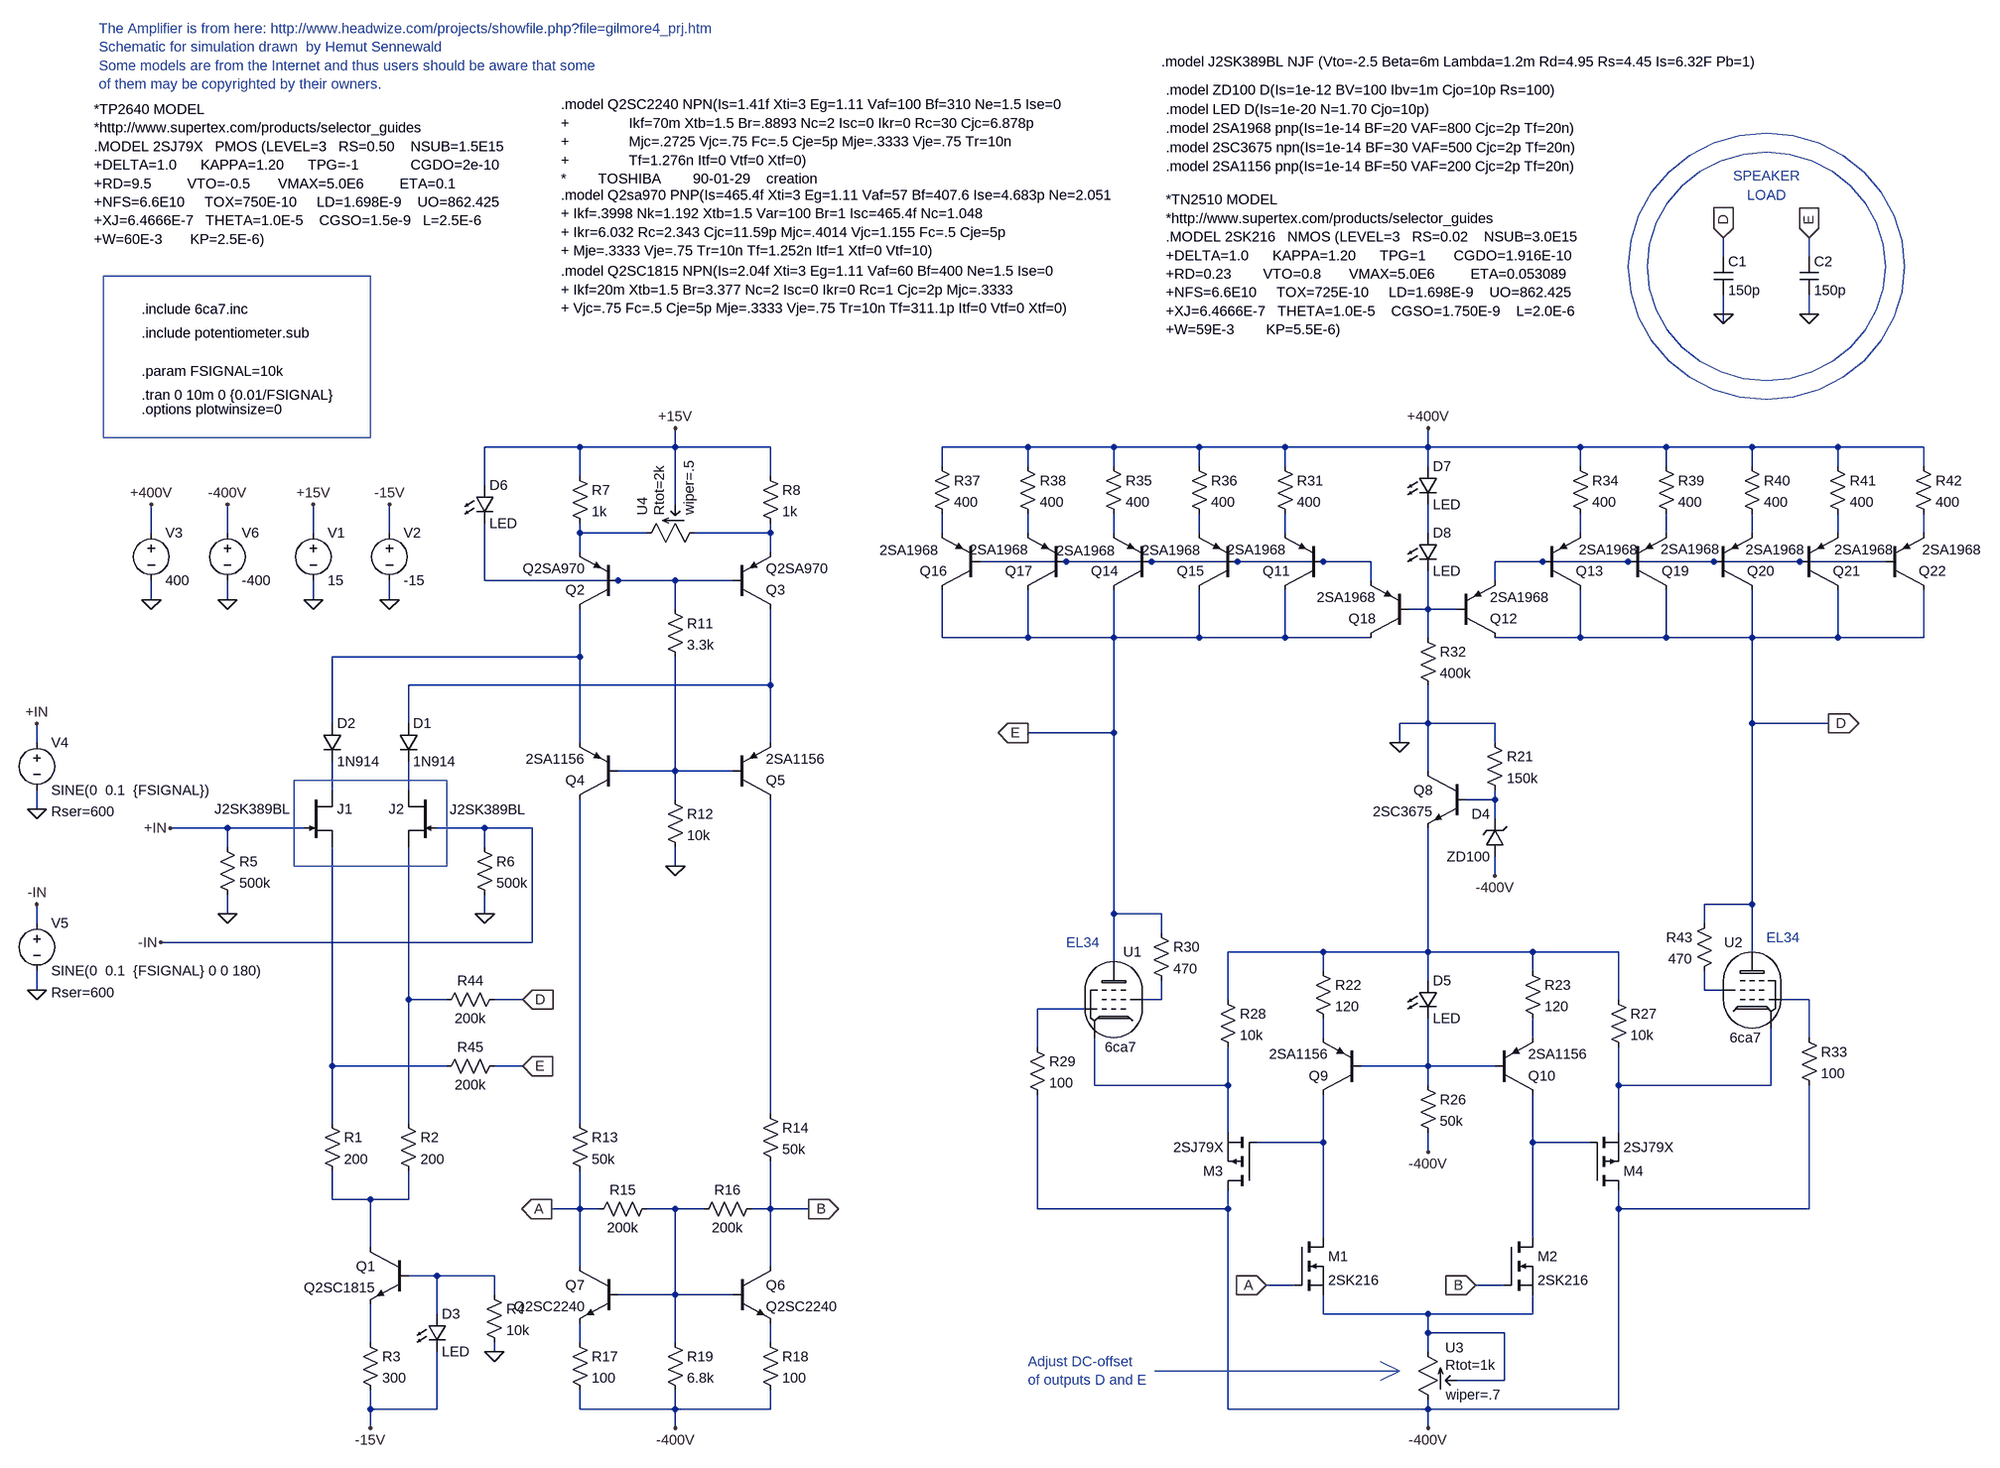
[diagram p0: schematic headwize4.asc]
headwize4.asc, the LTspice schematic file:
Version 4
SHEET 1 4132 1764
WIRE -448 -144 -448 -176
WIRE -448 -32 -448 -64
WIRE -448 160 -448 128
WIRE -448 272 -448 240
WIRE -256 -496 -256 -544
WIRE -256 -384 -256 -416
WIRE -128 -496 -128 -544
WIRE -128 -384 -128 -416
WIRE -128 0 -224 0
WIRE -128 32 -128 0
WIRE -128 144 -128 112
WIRE 0 0 -128 0
WIRE 16 -496 16 -544
WIRE 16 -384 16 -416
WIRE 48 -176 48 -288
WIRE 48 -64 48 -112
WIRE 48 400 48 32
WIRE 48 496 48 400
WIRE 48 624 48 576
WIRE 112 624 48 624
WIRE 112 704 112 624
WIRE 112 864 112 800
WIRE 112 976 112 944
WIRE 112 1008 112 976
WIRE 144 -496 144 -544
WIRE 144 -384 144 -416
WIRE 176 -176 176 -240
WIRE 176 -64 176 -112
WIRE 176 288 176 32
WIRE 176 496 176 288
WIRE 176 624 112 624
WIRE 176 624 176 576
WIRE 224 752 176 752
WIRE 224 816 224 752
WIRE 224 976 112 976
WIRE 224 976 224 880
WIRE 240 288 176 288
WIRE 240 400 48 400
WIRE 304 -576 304 -640
WIRE 304 -416 304 -512
WIRE 304 0 224 0
WIRE 304 32 304 0
WIRE 304 144 304 112
WIRE 320 752 224 752
WIRE 320 784 320 752
WIRE 320 880 320 864
WIRE 368 288 320 288
WIRE 368 400 320 400
WIRE 384 0 304 0
WIRE 384 192 -240 192
WIRE 384 192 384 0
WIRE 464 -640 304 -640
WIRE 464 -592 464 -640
WIRE 464 -496 464 -512
WIRE 464 -464 464 -496
WIRE 464 -288 48 -288
WIRE 464 -288 464 -368
WIRE 464 -144 464 -288
WIRE 464 496 464 -48
WIRE 464 640 416 640
WIRE 464 640 464 576
WIRE 464 736 464 640
WIRE 464 864 464 832
WIRE 464 976 464 944
WIRE 496 640 464 640
WIRE 528 -416 304 -416
WIRE 576 -496 464 -496
WIRE 624 -640 464 -640
WIRE 624 -640 624 -672
WIRE 624 -544 624 -640
WIRE 624 -416 528 -416
WIRE 624 -368 624 -416
WIRE 624 -96 528 -96
WIRE 624 -96 624 -288
WIRE 624 -48 624 -96
WIRE 624 64 624 32
WIRE 624 640 576 640
WIRE 624 784 528 784
WIRE 624 784 624 640
WIRE 624 864 624 784
WIRE 624 976 464 976
WIRE 624 976 624 944
WIRE 624 1008 624 976
WIRE 672 640 624 640
WIRE 720 -416 624 -416
WIRE 720 -96 624 -96
WIRE 720 784 624 784
WIRE 784 -640 624 -640
WIRE 784 -592 784 -640
WIRE 784 -496 656 -496
WIRE 784 -496 784 -512
WIRE 784 -464 784 -496
WIRE 784 -240 176 -240
WIRE 784 -240 784 -368
WIRE 784 -144 784 -240
WIRE 784 480 784 -48
WIRE 784 640 752 640
WIRE 784 640 784 560
WIRE 784 736 784 640
WIRE 784 864 784 832
WIRE 784 976 624 976
WIRE 784 976 784 944
WIRE 848 640 784 640
WIRE 1072 -608 1072 -640
WIRE 1072 -496 1072 -528
WIRE 1072 -320 1072 -400
WIRE 1216 -640 1072 -640
WIRE 1216 -608 1216 -640
WIRE 1216 -496 1216 -528
WIRE 1216 -320 1072 -320
WIRE 1216 -320 1216 -400
WIRE 1232 368 1232 304
WIRE 1232 640 1232 448
WIRE 1280 -448 1136 -448
WIRE 1312 304 1232 304
WIRE 1328 432 1328 352
WIRE 1360 -640 1216 -640
WIRE 1360 -608 1360 -640
WIRE 1360 -496 1360 -528
WIRE 1360 -320 1216 -320
WIRE 1360 -320 1360 -400
WIRE 1360 -160 1216 -160
WIRE 1360 -160 1360 -320
WIRE 1360 144 1360 -160
WIRE 1360 224 1360 144
WIRE 1424 -448 1280 -448
WIRE 1440 144 1360 144
WIRE 1440 176 1440 144
WIRE 1440 288 1408 288
WIRE 1440 288 1440 256
WIRE 1504 -640 1360 -640
WIRE 1504 -608 1504 -640
WIRE 1504 -496 1504 -528
WIRE 1504 -320 1360 -320
WIRE 1504 -320 1504 -400
WIRE 1552 288 1552 208
WIRE 1552 432 1328 432
WIRE 1552 432 1552 368
WIRE 1552 512 1552 432
WIRE 1552 640 1232 640
WIRE 1552 640 1552 608
WIRE 1552 976 1552 640
WIRE 1568 -448 1424 -448
WIRE 1648 -640 1504 -640
WIRE 1648 -608 1648 -640
WIRE 1648 -496 1648 -528
WIRE 1648 -320 1504 -320
WIRE 1648 -320 1648 -400
WIRE 1664 768 1616 768
WIRE 1712 -448 1568 -448
WIRE 1712 208 1552 208
WIRE 1712 240 1712 208
WIRE 1712 352 1712 320
WIRE 1712 528 1600 528
WIRE 1712 528 1712 448
WIRE 1712 688 1712 528
WIRE 1712 816 1712 784
WIRE 1792 -448 1712 -448
WIRE 1792 -416 1792 -448
WIRE 1792 -320 1648 -320
WIRE 1840 -144 1840 -176
WIRE 1888 -640 1648 -640
WIRE 1888 -640 1888 -672
WIRE 1888 -608 1888 -640
WIRE 1888 -496 1888 -544
WIRE 1888 -368 1856 -368
WIRE 1888 -368 1888 -432
WIRE 1888 -320 1888 -368
WIRE 1888 -176 1840 -176
WIRE 1888 -176 1888 -240
WIRE 1888 -96 1888 -176
WIRE 1888 208 1712 208
WIRE 1888 208 1888 0
WIRE 1888 256 1888 208
WIRE 1888 400 1776 400
WIRE 1888 400 1888 320
WIRE 1888 432 1888 400
WIRE 1888 544 1888 512
WIRE 1888 816 1712 816
WIRE 1888 848 1888 816
WIRE 1888 880 1888 848
WIRE 1888 976 1552 976
WIRE 1888 976 1888 960
WIRE 1888 1008 1888 976
WIRE 1936 -368 1888 -368
WIRE 2000 -416 2000 -448
WIRE 2000 -176 1888 -176
WIRE 2000 -144 2000 -176
WIRE 2000 -48 1952 -48
WIRE 2000 -48 2000 -64
WIRE 2000 -16 2000 -48
WIRE 2000 80 2000 48
WIRE 2000 400 1888 400
WIRE 2016 768 1968 768
WIRE 2016 848 1888 848
WIRE 2016 928 1936 928
WIRE 2016 928 2016 848
WIRE 2064 208 1888 208
WIRE 2064 240 2064 208
WIRE 2064 352 2064 320
WIRE 2064 528 2064 448
WIRE 2064 688 2064 528
WIRE 2064 816 1888 816
WIRE 2064 816 2064 784
WIRE 2080 -448 2000 -448
WIRE 2144 -640 1888 -640
WIRE 2144 -608 2144 -640
WIRE 2144 -496 2144 -528
WIRE 2144 -320 2000 -320
WIRE 2144 -320 2144 -400
WIRE 2160 528 2064 528
WIRE 2208 208 2064 208
WIRE 2208 288 2208 208
WIRE 2208 432 2208 368
WIRE 2208 512 2208 432
WIRE 2208 640 2208 608
WIRE 2208 976 1888 976
WIRE 2208 976 2208 640
WIRE 2224 -448 2080 -448
WIRE 2288 -640 2144 -640
WIRE 2288 -608 2288 -640
WIRE 2288 -496 2288 -528
WIRE 2288 -320 2144 -320
WIRE 2288 -320 2288 -400
WIRE 2352 160 2352 128
WIRE 2352 272 2352 240
WIRE 2368 -448 2224 -448
WIRE 2384 -960 2384 -992
WIRE 2384 -864 2384 -896
WIRE 2384 -848 2384 -864
WIRE 2384 272 2352 272
WIRE 2432 -640 2288 -640
WIRE 2432 -608 2432 -640
WIRE 2432 -496 2432 -528
WIRE 2432 -320 2288 -320
WIRE 2432 -320 2432 -400
WIRE 2432 -176 2432 -320
WIRE 2432 128 2352 128
WIRE 2432 128 2432 -176
WIRE 2432 208 2432 128
WIRE 2464 432 2208 432
WIRE 2464 432 2464 336
WIRE 2512 -448 2368 -448
WIRE 2528 -960 2528 -992
WIRE 2528 -864 2528 -896
WIRE 2528 288 2480 288
WIRE 2528 352 2528 288
WIRE 2528 640 2208 640
WIRE 2528 640 2528 432
WIRE 2560 -176 2432 -176
WIRE 2576 -640 2432 -640
WIRE 2576 -608 2576 -640
WIRE 2576 -496 2576 -528
WIRE 2576 -320 2432 -320
WIRE 2576 -320 2576 -400
WIRE 2656 -448 2512 -448
WIRE 2720 -640 2576 -640
WIRE 2720 -608 2720 -640
WIRE 2720 -496 2720 -528
WIRE 2720 -320 2576 -320
WIRE 2720 -320 2720 -400
FLAG 320 880 0
FLAG 112 1008 -15V
FLAG 304 144 0
FLAG -128 144 0
FLAG 624 64 0
FLAG 624 -672 +15V
FLAG 624 1008 -400V
FLAG -224 0 +IN
FLAG -240 192 -IN
FLAG 144 -384 0
FLAG 16 -384 0
FLAG 144 -544 -15V
FLAG 16 -544 +15V
FLAG -448 -32 0
FLAG -448 272 0
FLAG -448 -176 +IN
FLAG -448 128 -IN
FLAG -256 -384 0
FLAG -256 -544 +400V
FLAG -128 -384 0
FLAG -128 -544 -400V
FLAG 1968 768 B
IOPIN 1968 768 In
FLAG 848 640 B
IOPIN 848 640 Out
FLAG 416 640 A
IOPIN 416 640 Out
FLAG 1616 768 A
IOPIN 1616 768 In
FLAG 1888 1008 -400V
FLAG 1840 -144 0
FLAG 2000 80 -400V
FLAG 1888 544 -400V
FLAG 1888 -672 +400V
FLAG 368 288 D
IOPIN 368 288 In
FLAG 368 400 E
IOPIN 368 400 In
FLAG 2560 -176 D
IOPIN 2560 -176 Out
FLAG 1216 -160 E
IOPIN 1216 -160 Out
FLAG 2384 -864 0
FLAG 2528 -864 0
FLAG 2384 -992 D
IOPIN 2384 -992 In
FLAG 2528 -992 E
IOPIN 2528 -992 In
SYMBOL njf 0 -64 R0
WINDOW 3 -150 32 Left 0
SYMATTR Value J2SK389BL
SYMATTR InstName J1
SYMBOL njf 224 -64 M0
WINDOW 3 -148 33 Left 0
SYMATTR Value J2SK389BL
SYMATTR InstName J2
SYMBOL diode 160 -176 R0
SYMATTR InstName D1
SYMATTR Value 1N914
SYMBOL diode 32 -176 R0
SYMATTR InstName D2
SYMATTR Value 1N914
SYMBOL res 32 480 R0
SYMATTR InstName R1
SYMATTR Value 200
SYMBOL res 160 480 R0
SYMATTR InstName R2
SYMATTR Value 200
SYMBOL npn 176 704 M0
SYMATTR InstName Q1
SYMATTR Value Q2SC1815
SYMBOL res 96 848 R0
SYMATTR InstName R3
SYMATTR Value 300
SYMBOL res 304 768 R0
SYMATTR InstName R4
SYMATTR Value 10k
SYMBOL res -144 16 R0
SYMATTR InstName R5
SYMATTR Value 500k
SYMBOL res 288 16 R0
SYMATTR InstName R6
SYMATTR Value 500k
SYMBOL pnp 528 -368 R180
SYMATTR InstName Q2
SYMATTR Value Q2SA970
SYMBOL pnp 720 -368 M180
SYMATTR InstName Q3
SYMATTR Value Q2SA970
SYMBOL res 448 -608 R0
SYMATTR InstName R7
SYMATTR Value 1k
SYMBOL res 768 -608 R0
SYMATTR InstName R8
SYMATTR Value 1k
SYMBOL pnp 528 -48 R180
SYMATTR InstName Q4
SYMATTR Value 2SA1156
SYMBOL pnp 720 -48 M180
SYMATTR InstName Q5
SYMATTR Value 2SA1156
SYMBOL res 608 -384 R0
SYMATTR InstName R11
SYMATTR Value 3.3k
SYMBOL res 608 -64 R0
SYMATTR InstName R12
SYMATTR Value 10k
SYMBOL res 448 480 R0
SYMATTR InstName R13
SYMATTR Value 50k
SYMBOL res 768 464 R0
SYMATTR InstName R14
SYMATTR Value 50k
SYMBOL npn 720 736 R0
SYMATTR InstName Q6
SYMATTR Value Q2SC2240
SYMBOL npn 528 736 M0
SYMATTR InstName Q7
SYMATTR Value Q2SC2240
SYMBOL res 480 656 R270
WINDOW 0 32 56 VTop 0
WINDOW 3 0 56 VBottom 0
SYMATTR InstName R15
SYMATTR Value 200k
SYMBOL res 656 656 R270
WINDOW 0 32 56 VTop 0
WINDOW 3 0 56 VBottom 0
SYMATTR InstName R16
SYMATTR Value 200k
SYMBOL res 448 848 R0
SYMATTR InstName R17
SYMATTR Value 100
SYMBOL res 768 848 R0
SYMATTR InstName R18
SYMATTR Value 100
SYMBOL res 608 848 R0
SYMATTR InstName R19
SYMATTR Value 6.8k
SYMBOL voltage 16 -512 R0
SYMATTR InstName V1
SYMATTR Value 15
SYMBOL voltage 144 -512 R0
SYMATTR InstName V2
SYMATTR Value -15
SYMBOL voltage -448 -160 R0
WINDOW 123 0 0 Left 0
WINDOW 39 24 132 Left 0
SYMATTR SpiceLine Rser=600
SYMATTR InstName V4
SYMATTR Value SINE(0  0.1  {FSIGNAL})
SYMBOL voltage -448 144 R0
WINDOW 123 0 0 Left 0
WINDOW 39 24 132 Left 0
SYMATTR SpiceLine Rser=600
SYMATTR InstName V5
SYMATTR Value SINE(0  0.1  {FSIGNAL} 0 0 180)
SYMBOL LED 288 -576 R0
SYMATTR InstName D6
SYMATTR Value LED
SYMBOL LED 208 816 R0
SYMATTR InstName D3
SYMATTR Value LED
SYMBOL voltage -256 -512 R0
SYMATTR InstName V3
SYMATTR Value 400
SYMBOL voltage -128 -512 R0
SYMATTR InstName V6
SYMATTR Value -400
SYMBOL nmos 1664 688 R0
SYMATTR InstName M1
SYMATTR Value 2SK216
SYMBOL nmos 2016 688 R0
SYMATTR InstName M2
SYMATTR Value 2SK216
SYMBOL npn 1952 -96 M0
SYMATTR InstName Q8
SYMATTR Value 2SC3675
SYMBOL res 1984 -160 R0
SYMATTR InstName R21
SYMATTR Value 150k
SYMBOL zener 2016 48 R180
WINDOW 0 24 72 Left 0
WINDOW 3 24 0 Left 0
SYMATTR InstName D4
SYMATTR Value ZD100
SYMBOL pnp 1776 448 R180
SYMATTR InstName Q9
SYMATTR Value 2SA1156
SYMBOL pnp 2000 448 M180
SYMATTR InstName Q10
SYMATTR Value 2SA1156
SYMBOL res 1696 224 R0
SYMATTR InstName R22
SYMATTR Value 120
SYMBOL res 2048 224 R0
SYMATTR InstName R23
SYMATTR Value 120
SYMBOL res 1872 416 R0
SYMATTR InstName R26
SYMATTR Value 50k
SYMBOL LED 1872 256 R0
SYMATTR InstName D5
SYMATTR Value LED
SYMBOL pmos 1600 608 R180
SYMATTR InstName M3
SYMATTR Value 2SJ79X
SYMBOL pmos 2160 608 M180
SYMATTR InstName M4
SYMATTR Value 2SJ79X
SYMBOL res 2192 272 R0
SYMATTR InstName R27
SYMATTR Value 10k
SYMBOL res 1536 272 R0
SYMATTR InstName R28
SYMATTR Value 10k
SYMBOL xpentode4 1360 288 R0
SYMATTR InstName U1
SYMATTR Value 6ca7
SYMBOL res 1424 160 R0
SYMATTR InstName R30
SYMATTR Value 470
SYMBOL pnp 1712 -400 R180
WINDOW 3 63 68 Left 0
SYMATTR Value 2SA1968
SYMATTR InstName Q11
SYMBOL pnp 1936 -320 M180
SYMATTR InstName Q12
SYMATTR Value 2SA1968
SYMBOL res 1632 -624 R0
SYMATTR InstName R31
SYMATTR Value 400
SYMBOL LED 1872 -608 R0
SYMATTR InstName D7
SYMATTR Value LED
SYMBOL pnp 1424 -400 R180
WINDOW 3 61 66 Left 0
SYMATTR Value 2SA1968
SYMATTR InstName Q14
SYMBOL res 1344 -624 R0
SYMATTR InstName R35
SYMATTR Value 400
SYMBOL pnp 1568 -400 R180
WINDOW 3 62 67 Left 0
SYMATTR Value 2SA1968
SYMATTR InstName Q15
SYMBOL res 1488 -624 R0
SYMATTR InstName R36
SYMATTR Value 400
SYMBOL pnp 1136 -400 R180
WINDOW 3 70 67 Left 0
SYMATTR Value 2SA1968
SYMATTR InstName Q16
SYMBOL res 1056 -624 R0
SYMATTR InstName R37
SYMATTR Value 400
SYMBOL pnp 1280 -400 R180
WINDOW 3 63 68 Left 0
SYMATTR Value 2SA1968
SYMATTR InstName Q17
SYMBOL res 1200 -624 R0
SYMATTR InstName R38
SYMATTR Value 400
SYMBOL pnp 1856 -320 R180
SYMATTR InstName Q18
SYMATTR Value 2SA1968
SYMBOL pnp 2080 -400 M180
WINDOW 3 61 68 Left 0
SYMATTR Value 2SA1968
SYMATTR InstName Q13
SYMBOL res 2128 -624 R0
SYMATTR InstName R34
SYMATTR Value 400
SYMBOL pnp 2224 -400 M180
WINDOW 3 55 69 Left 0
SYMATTR Value 2SA1968
SYMATTR InstName Q19
SYMBOL res 2272 -624 R0
SYMATTR InstName R39
SYMATTR Value 400
SYMBOL pnp 2368 -400 M180
WINDOW 3 53 68 Left 0
SYMATTR Value 2SA1968
SYMATTR InstName Q20
SYMBOL res 2416 -624 R0
SYMATTR InstName R40
SYMATTR Value 400
SYMBOL pnp 2512 -400 M180
WINDOW 3 58 68 Left 0
SYMATTR Value 2SA1968
SYMATTR InstName Q21
SYMBOL res 2560 -624 R0
SYMATTR InstName R41
SYMATTR Value 400
SYMBOL pnp 2656 -400 M180
WINDOW 3 62 68 Left 0
SYMATTR Value 2SA1968
SYMATTR InstName Q22
SYMBOL res 2704 -624 R0
SYMATTR InstName R42
SYMATTR Value 400
SYMBOL res 1872 -336 R0
SYMATTR InstName R32
SYMATTR Value 400k
SYMBOL LED 1872 -496 R0
SYMATTR InstName D8
SYMATTR Value LED
SYMBOL xpentode4 2432 272 M0
SYMATTR InstName U2
SYMATTR Value 6ca7
SYMBOL res 2368 144 M0
SYMATTR InstName R43
SYMATTR Value 470
SYMBOL res 224 304 R270
WINDOW 0 32 56 VTop 0
WINDOW 3 0 56 VBottom 0
SYMATTR InstName R44
SYMATTR Value 200k
SYMBOL res 224 416 R270
WINDOW 0 32 56 VTop 0
WINDOW 3 0 56 VBottom 0
SYMATTR InstName R45
SYMATTR Value 200k
SYMBOL res 1216 352 R0
SYMATTR InstName R29
SYMATTR Value 100
SYMBOL res 2512 336 R0
SYMATTR InstName R33
SYMATTR Value 100
SYMBOL cap 2368 -960 R0
SYMATTR InstName C1
SYMATTR Value 150p
SYMBOL cap 2512 -960 R0
SYMATTR InstName C2
SYMATTR Value 150p
SYMBOL potentiometer-1 1872 864 R0
SYMATTR InstName U3
SYMATTR Value Rtot=1k
SYMATTR SpiceLine wiper=.7
SYMBOL potentiometer-1 560 -480 R270
SYMATTR InstName U4
SYMATTR Value Rtot=2k
TEXT -272 -728 Left 0 !.tran 0 10m 0 {0.01/FSIGNAL}
TEXT 1448 -1208 Left 0 !.model LED D(Is=1e-20 N=1.70 Cjo=10p)
TEXT 1448 -1240 Left 0 !.model ZD100 D(Is=1e-12 BV=100 Ibv=1m Cjo=10p Rs=100)
TEXT 1440 -1288 Left 0 !.model J2SK389BL NJF (Vto=-2.5 Beta=6m Lambda=1.2m Rd=4.95 Rs=4.45 Is=6.32F Pb=1)
TEXT -272 -872 Left 0 !.include 6ca7.inc
TEXT -272 -704 Left 0 !.options plotwinsize=0
TEXT -272 -768 Left 0 !.param FSIGNAL=10k
TEXT 432 -1064 Left 0 !.model Q2sa970 PNP(Is=465.4f Xti=3 Eg=1.11 Vaf=57 Bf=407.6 Ise=4.683p Ne=2.051\n+ Ikf=.3998 Nk=1.192 Xtb=1.5 Var=100 Br=1 Isc=465.4f Nc=1.048\n+ Ikr=6.032 Rc=2.343 Cjc=11.59p Mjc=.4014 Vjc=1.155 Fc=.5 Cje=5p\n+ Mje=.3333 Vje=.75 Tr=10n Tf=1.252n Itf=1 Xtf=0 Vtf=10)
TEXT 432 -1216 Left 0 !.model Q2SC2240 NPN(Is=1.41f Xti=3 Eg=1.11 Vaf=100 Bf=310 Ne=1.5 Ise=0\n+               Ikf=70m Xtb=1.5 Br=.8893 Nc=2 Isc=0 Ikr=0 Rc=30 Cjc=6.878p\n+               Mjc=.2725 Vjc=.75 Fc=.5 Cje=5p Mje=.3333 Vje=.75 Tr=10n\n+               Tf=1.276n Itf=0 Vtf=0 Xtf=0)\n*		TOSHIBA		90-01-29	creation
TEXT 1448 -1176 Left 0 !.model 2SA1968 pnp(Is=1e-14 BF=20 VAF=800 Cjc=2p Tf=20n)
TEXT 1448 -1144 Left 0 !.model 2SC3675 npn(Is=1e-14 BF=30 VAF=500 Cjc=2p Tf=20n)
TEXT 1448 -1112 Left 0 !.model 2SA1156 pnp(Is=1e-14 BF=50 VAF=200 Cjc=2p Tf=20n)
TEXT -352 -1208 Left 0 !*TP2640 MODEL\n*http://www.supertex.com/products/selector_guides\n.MODEL 2SJ79X   PMOS (LEVEL=3   RS=0.50    NSUB=1.5E15\n+DELTA=1.0      KAPPA=1.20      TPG=-1             CGDO=2e-10\n+RD=9.5         VTO=-0.5       VMAX=5.0E6         ETA=0.1\n+NFS=6.6E10     TOX=750E-10     LD=1.698E-9    UO=862.425\n+XJ=6.4666E-7   THETA=1.0E-5    CGSO=1.5e-9   L=2.5E-6\n+W=60E-3       KP=2.5E-6)
TEXT 1448 -1056 Left 0 !*TN2510 MODEL\n*http://www.supertex.com/products/selector_guides\n.MODEL 2SK216   NMOS (LEVEL=3   RS=0.02    NSUB=3.0E15\n+DELTA=1.0      KAPPA=1.20      TPG=1       CGDO=1.916E-10\n+RD=0.23        VTO=0.8       VMAX=5.0E6         ETA=0.053089\n+NFS=6.6E10     TOX=725E-10     LD=1.698E-9    UO=862.425\n+XJ=6.4666E-7   THETA=1.0E-5    CGSO=1.750E-9    L=2.0E-6\n+W=59E-3        KP=5.5E-6)
TEXT 2424 -1064 Left 0 ;LOAD
TEXT 2400 -1096 Left 0 ;SPEAKER
TEXT -344 -1344 Left 0 ;The Amplifier is from here: http://www.headwize.com/projects/showfile.php?file=gilmore4_prj.htm\nSchematic for simulation drawn  by Hemut Sennewald\nSome models are from the Internet and thus users should be aware that some\nof them may be copyrighted by their owners.
TEXT 1216 896 Left 0 ;Adjust DC-offset \nof outputs D and E
TEXT -272 -832 Left 0 !.include potentiometer.sub
TEXT 1280 192 Left 0 ;EL34
TEXT 2456 184 Left 0 ;EL34
TEXT 432 -936 Left 0 !.model Q2SC1815 NPN(Is=2.04f Xti=3 Eg=1.11 Vaf=60 Bf=400 Ne=1.5 Ise=0\n+ Ikf=20m Xtb=1.5 Br=3.377 Nc=2 Isc=0 Ikr=0 Rc=1 Cjc=2p Mjc=.3333\n+ Vjc=.75 Fc=.5 Cje=5p Mje=.3333 Vje=.75 Tr=10n Tf=311.1p Itf=0 Vtf=0 Xtf=0)
LINE Normal 1429 912 1840 912
LINE Normal 1808 896 1840 912
LINE Normal 1808 912 1840 912
LINE Normal 1808 928 1840 912
RECTANGLE Normal 240 64 -16 -80
RECTANGLE Normal 112 -656 -336 -928
CIRCLE Normal 2656 -752 2256 -1136
CIRCLE Normal 2688 -720 2224 -1168

The netlist it stands for:
* headwize4.asc
J1 N002 +IN N003 J2SK389BL
J2 N007 -IN N008 J2SK389BL
D1 N006 N007 1N914
D2 N001 N002 1N914
R1 N003 N004 200
R2 N008 N004 200
Q1 N004 N009 N005 0 Q2SC1815
R3 N005 -15V 300
R4 N009 0 10k
R5 +IN 0 500k
R6 -IN 0 500k
Q2 N001 N010 N011 0 Q2SA970
Q3 N006 N010 N016 0 Q2SA970
R7 +15V N011 1k
R8 +15V N016 1k
Q4 N012 N014 N001 0 2SA1156
Q5 N017 N014 N006 0 2SA1156
R11 N010 N014 3.3k
R12 N014 0 10k
R13 N012 A 50k
R14 N017 B 50k
Q6 B N015 N018 0 Q2SC2240
Q7 A N015 N013 0 Q2SC2240
R15 A N015 200k
R16 N015 B 200k
R17 N013 -400V 100
R18 N018 -400V 100
R19 N015 -400V 6.8k
V1 +15V 0 15
V2 -15V 0 -15
V4 +IN 0 SINE(0  0.1  {FSIGNAL}) Rser=600
V5 -IN 0 SINE(0  0.1  {FSIGNAL} 0 0 180) Rser=600
D6 +15V N010 LED
D3 N009 -15V LED
V3 +400V 0 400
V6 -400V 0 -400
M1 N030 A N031 N031 2SK216
M2 N038 B N031 N031 2SK216
Q8 0 N036 N027 0 2SC3675
R21 0 N036 150k
D4 -400V N036 ZD100
Q9 N030 N034 N029 0 2SA1156
Q10 N038 N034 N037 0 2SA1156
R22 N027 N029 120
R23 N027 N037 120
R26 N034 -400V 50k
D5 N027 N034 LED
M3 -400V N030 N023 N023 2SJ79X
M4 -400V N038 N040 N040 2SJ79X
R27 N027 N040 10k
R28 N027 N023 10k
XU1 E N025 N021 N023 6ca7  ; pins Anode G2 G1 Cathode
R30 E N025 470
Q11 E N022 N028 0 2SA1968
Q12 D N033 N035 0 2SA1968
R31 +400V N028 400
D7 +400V N032 LED
Q14 E N022 N024 0 2SA1968
R35 +400V N024 400
Q15 E N022 N026 0 2SA1968
R36 +400V N026 400
Q16 E N022 N019 0 2SA1968
R37 +400V N019 400
Q17 E N022 N020 0 2SA1968
R38 +400V N020 400
Q18 E N033 N022 0 2SA1968
Q13 D N035 N039 0 2SA1968
R34 +400V N039 400
Q19 D N035 N041 0 2SA1968
R39 +400V N041 400
Q20 D N035 N043 0 2SA1968
R40 +400V N043 400
Q21 D N035 N045 0 2SA1968
R41 +400V N045 400
Q22 D N035 N046 0 2SA1968
R42 +400V N046 400
R32 N033 0 400k
D8 N032 N033 LED
XU2 D N042 N044 N040 6ca7  ; pins Anode G2 G1 Cathode
R43 D N042 470
R44 N008 D 200k
R45 N003 E 200k
R29 N021 -400V 100
R33 N044 -400V 100
C1 D 0 150p
C2 E 0 150p
XU3 N031 -400V N031 potentiometer Rtot=1k wiper=.7  ; pins A B C
XU4 N011 N016 +15V potentiometer Rtot=2k wiper=.5  ; pins A B C
.model D D
.lib standard.dio
.model NPN NPN
.model PNP PNP
.lib standard.bjt
.model NJF NJF
.model PJF PJF
.lib standard.jft
.model NMOS NMOS
.model PMOS PMOS
.lib standard.mos
.tran 0 10m 0 {0.01/FSIGNAL}
.model LED D(Is=1e-20 N=1.70 Cjo=10p)
.model ZD100 D(Is=1e-12 BV=100 Ibv=1m Cjo=10p Rs=100)
.model J2SK389BL NJF (Vto=-2.5 Beta=6m Lambda=1.2m Rd=4.95 Rs=4.45 Is=6.32F Pb=1)
.include 6ca7.inc
.options plotwinsize=0
.param FSIGNAL=10k
.model Q2sa970 PNP(Is=465.4f Xti=3 Eg=1.11 Vaf=57 Bf=407.6 Ise=4.683p Ne=2.051
+ Ikf=.3998 Nk=1.192 Xtb=1.5 Var=100 Br=1 Isc=465.4f Nc=1.048
+ Ikr=6.032 Rc=2.343 Cjc=11.59p Mjc=.4014 Vjc=1.155 Fc=.5 Cje=5p
+ Mje=.3333 Vje=.75 Tr=10n Tf=1.252n Itf=1 Xtf=0 Vtf=10)
.model Q2SC2240 NPN(Is=1.41f Xti=3 Eg=1.11 Vaf=100 Bf=310 Ne=1.5 Ise=0
+               Ikf=70m Xtb=1.5 Br=.8893 Nc=2 Isc=0 Ikr=0 Rc=30 Cjc=6.878p
+               Mjc=.2725 Vjc=.75 Fc=.5 Cje=5p Mje=.3333 Vje=.75 Tr=10n
+               Tf=1.276n Itf=0 Vtf=0 Xtf=0)
*		TOSHIBA		90-01-29	creation
.model 2SA1968 pnp(Is=1e-14 BF=20 VAF=800 Cjc=2p Tf=20n)
.model 2SC3675 npn(Is=1e-14 BF=30 VAF=500 Cjc=2p Tf=20n)
.model 2SA1156 pnp(Is=1e-14 BF=50 VAF=200 Cjc=2p Tf=20n)
*TP2640 MODEL
*http://www.supertex.com/products/selector_guides
.MODEL 2SJ79X   PMOS (LEVEL=3   RS=0.50    NSUB=1.5E15
+DELTA=1.0      KAPPA=1.20      TPG=-1             CGDO=2e-10
+RD=9.5         VTO=-0.5       VMAX=5.0E6         ETA=0.1
+NFS=6.6E10     TOX=750E-10     LD=1.698E-9    UO=862.425
+XJ=6.4666E-7   THETA=1.0E-5    CGSO=1.5e-9   L=2.5E-6
+W=60E-3       KP=2.5E-6)
*TN2510 MODEL
*http://www.supertex.com/products/selector_guides
.MODEL 2SK216   NMOS (LEVEL=3   RS=0.02    NSUB=3.0E15
+DELTA=1.0      KAPPA=1.20      TPG=1       CGDO=1.916E-10
+RD=0.23        VTO=0.8       VMAX=5.0E6         ETA=0.053089
+NFS=6.6E10     TOX=725E-10     LD=1.698E-9    UO=862.425
+XJ=6.4666E-7   THETA=1.0E-5    CGSO=1.750E-9    L=2.0E-6
+W=59E-3        KP=5.5E-6)
* LOAD
* SPEAKER
* The Amplifier is from here: http://www.headwize.com/projects/showfile.php?file=gilmore4_prj.htm
* Schematic for simulation drawn  by Hemut Sennewald
* Some models are from the Internet and thus users should be aware that some
* of them may be copyrighted by their owners.
* Adjust DC-offset
* of outputs D and E
.include potentiometer.sub
* EL34
* EL34
.model Q2SC1815 NPN(Is=2.04f Xti=3 Eg=1.11 Vaf=60 Bf=400 Ne=1.5 Ise=0
+ Ikf=20m Xtb=1.5 Br=3.377 Nc=2 Isc=0 Ikr=0 Rc=1 Cjc=2p Mjc=.3333
+ Vjc=.75 Fc=.5 Cje=5p Mje=.3333 Vje=.75 Tr=10n Tf=311.1p Itf=0 Vtf=0 Xtf=0)
.backanno
.end